# Altium project IDEC Power Board.PrjPcb
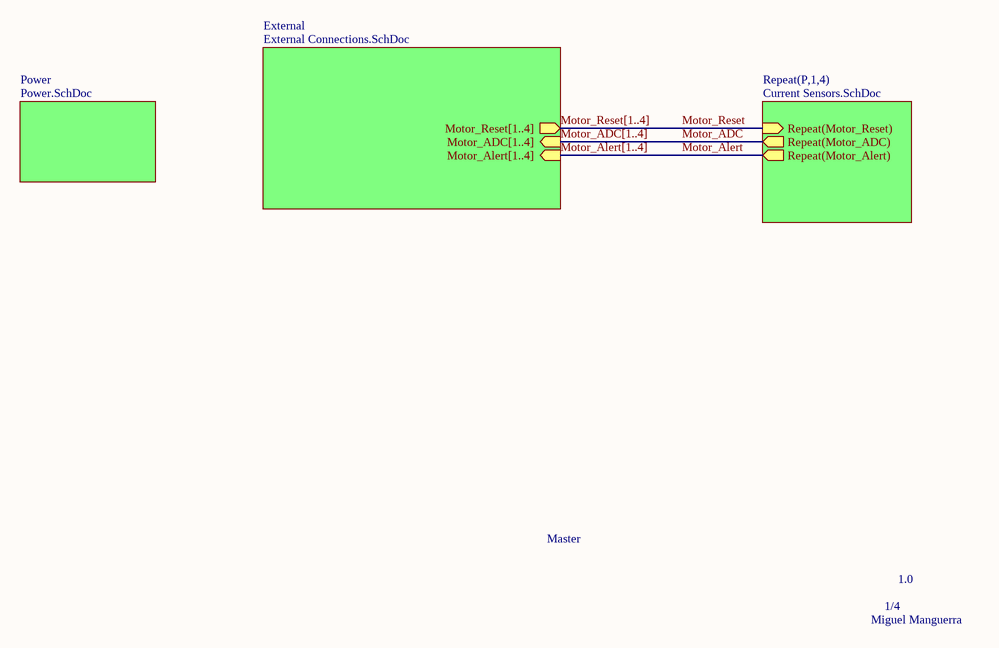
[diagram p0: Master.SchDoc]
4 sheets, 80 parts. Net scope: hierarchical (ports join the sheet entries above them; power ports are global).
Board files: Kimiya Board.PcbDoc, Miguel Board.PcbDoc, IDEC Power Board Mk1.0.PcbDoc
Sheets:
  Master.SchDoc
    Power = Power.SchDoc
    External = External Connections.SchDoc
    P1 = Current Sensors.SchDoc
    P2 = Current Sensors.SchDoc
    P3 = Current Sensors.SchDoc
    P4 = Current Sensors.SchDoc

## Sheet Master.SchDoc
size A; SheetNumber: 1; SheetTotal: 4

### Sub-sheets
External = External Connections.SchDoc: Motor_Reset[1..4] (out), Motor_ADC[1..4] (in), Motor_Alert[1..4] (in)
Power = Power.SchDoc: no entries
Repeat(P,1,4) = Current Sensors.SchDoc: Repeat(Motor_Alert) (out), Repeat(Motor_Reset) (in), Repeat(Motor_ADC) (out)

### Nets
Motor_ADC: sheet Repeat(P,1,4)/Repeat(Motor_ADC)
Motor_Alert: sheet Repeat(P,1,4)/Repeat(Motor_Alert)
Motor_Reset: sheet Repeat(P,1,4)/Repeat(Motor_Reset)

### Buses and harness runs
bus Motor_ADC[1..4] = sheet External/Motor_ADC[1..4]
bus Motor_Alert[1..4] = sheet External/Motor_Alert[1..4]
bus Motor_Reset[1..4] = sheet External/Motor_Reset[1..4]

### Notes on the sheet
- Master
- 1/4
- 1.0
- Miguel Manguerra

## Sheet Power.SchDoc
size A; SheetNumber: 2; SheetTotal: 4
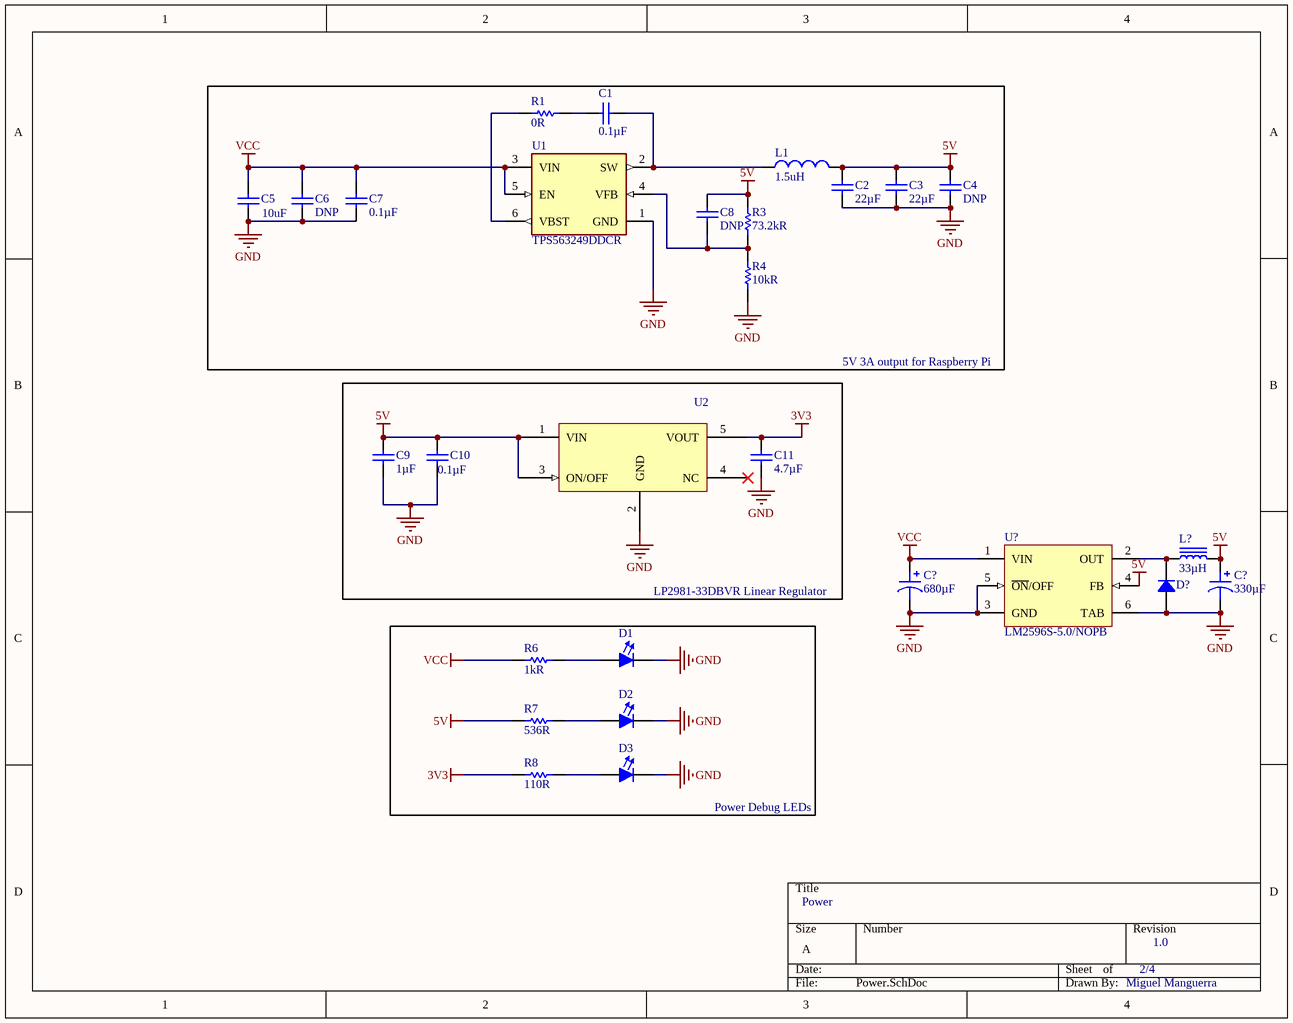
[diagram p1: Power.SchDoc]

### Parts
(Parts that share a designator on the sheet are numbered #1, #2 ... from top to bottom, then left to right.)
C1  Capacitance: 0.1µF  [CAPC1608N(0603")]  (hidden comment: 0.1uF, 50V, 10%, X7R, 0603)
C2  value 22µF  [CAPC2012N(0805")]  (hidden comment: 22uF 35V 0805 SMD, Ceramic)
C3  value 22µF  [CAPC2012N(0805")]  (hidden comment: 22uF 35V 0805 SMD, Ceramic)
C4  value DNP  [CAPC1608N(0603")]  (hidden comment: Placeholder_Capacitor_0603)
C5  Capacitance: 10uF  [CAPC2013X12N]  (hidden comment: 10uF, 25V, X5R, 0805)
C6  value DNP  [CAPC3216N(1206")]  (hidden comment: Placeholder_Capacitor_1206)
C7  Capacitance: 0.1µF  [CAPC1608N(0603")]  (hidden comment: 0.1uF, 50V, 10%, X7R, 0603)
C8  value DNP  [CAPC1608N(0603")]  (hidden comment: Placeholder_Capacitor_0603)
C9  value 1µF  [CAPC1608N(0603")]  (hidden comment: 1uF 25V 0603 SMD, Ceramic)
C10  value 0.1µF  [CAPC1608N(0603")]  (hidden comment: 0.1uF 16V 0603 SMD, Ceramic)
C11  value 4.7µF  [CAPC1608N(0603")]  (hidden comment: 4.7uF 10V 0603 SMD, Ceramic)
C?#1  680µF  [CAP ALSMD 8.3MM H10.5MM]
C?#2  330µF  [CAP ALSMD 8.3MM H10.5MM]
D1  LT Q39G-Q1OO-25-1  [FP-LB_Q39E-MFG]  (value not drawn)
D2  LT Q39G-Q1OO-25-1  [FP-LB_Q39E-MFG]  (value not drawn)
D3  LT Q39G-Q1OO-25-1  [FP-LB_Q39E-MFG]  (value not drawn)
D?  MBRS360BT3G  [DO214AA SMB]  (value not drawn)
L1  Inductance: 1.5uH  [INDC2520X12N]  (hidden comment: DFE252012P-1R5M=P2)
L?  33µH  [BOURNS SRR1280]
R1  value 0R  [RESC1608N(0603")]  (hidden comment: 0R, 1%, 1/10W, 0603 SMD)
R3  Resistance: 73.2kR  [RESC1608X55X30LL15T15]  (hidden comment: ERJ-3EKF7322V)
R4  Resistance: 10kR  [RESC1608X55X25ML10T15]  (hidden comment: RC0603FR-0710KL)
R6  Resistance: 1kR  [RESC1608X55X30ML15T15]  (hidden comment: ERJ3EKF1001V)
R7  536R  [RESC1608X55X30ML15T15]
R8  110R  [RESC1608X55X25ML10T15]
U1  TPS563249DDCR  [FP-DDC0005A-IPC_B]
U2  LP2981-33DBVR  [SOT95P280X145-5N]  (value not drawn)
U?  LM2596S-5.0/NOPB  [KTT0005B_M]

### Blocks framed on the sheet
5V 3A output for Raspberry Pi: C1-C8 L1 R1 R3 R4 U1

### Nets
3V3: C11.2(Cathode) R8.1 U2.5(VOUT)
5V: C2.2(Cathode) C3.2(Cathode) C4.2(Cathode) C8.2(Cathode) C9.2(Cathode) C10.2(Cathode) C?#2.1 L1.2 L?.2 R3.2 R7.1 U2.1(VIN) U2.3(ON/OFF) U?.4(FB)
GND: C2.1(Anode) C3.1(Anode) C4.1(Anode) C5.2 C6.1(Anode) C7.1(Anode) C9.1(Anode) C10.1(Anode) C11.1(Anode) C?#1.2 C?#2.2 D1.1(Cathode) D2.1(Cathode) D3.1(Cathode) D?.1 R4.1 U1.1(GND) U2.2(GND) U?.3(GND) U?.5(~{ON}/OFF) U?.6(TAB)
VCC: C5.1 C6.2(Cathode) C7.2(Cathode) C?#1.1 R6.1 U1.3(VIN) U1.5(EN) U?.1(VIN)
NetC1_1: C1.1(Anode) L1.1 U1.2(SW)
NetC1_2: C1.2(Cathode) R1.2
NetC8_1: C8.1(Anode) R3.1 R4.2 U1.4(VFB)
NetD1_2: D1.2(Anode) R6.2
NetD2_2: D2.2(Anode) R7.2
NetD3_2: D3.2(Anode) R8.2
NetD?_2: D?.2 L?.1 U?.2(OUT)
NetR1_1: R1.1 U1.6(VBST)

Not connected (* = marked no-connect by the designer): U2 4(NC)*

### Notes on the sheet
- LP2981-33DBVR Linear Regulator
- Power Debug LEDs
- Power
- 2/4
- 1.0
- Miguel Manguerra

### Library data of the parts
C1 C7 = CMP-006-0007-1: 0.1µF ±10% Ceramic Capacitor X7R 0603 (1608 Metric); Operating Temperature: -55°C ~ 125°C; Pin Count: 2; Design Item ID: 0.1uF, 50V, 10%, X7R, 0603; Package / Case: 0603 (1608 Metric); Source: AUVic_Schematic_Library_Capacitors.SchLib; ComponentLink1URL: https://www.digikey.ca/product-detail/en/tdk-corporation/C1608X7R1H104M080AA/445-5098-1-ND/2093713; ComponentLink1Description: Digi-Key; Mounting Type: Surface Mount, MLCC; Component Type: Standard; Created By: Poorna Chander Kalidas
C2 C3 = CMP-006-0036-1: Capacitor, Ceramic, 35V, +/- 20%, 0805 SMD, X5R; Design Item ID: 22uF 35V 0805 SMD, Ceramic; Source: AUVic_Schematic_Library_Capacitors.SchLib; Pin Count: 2; Component Type: Standard; Publisher: AUVic; PackageDescription: Chip Capacitor; Published: 14-06-01
C4 C8 = CMP-006-0054-1: Placeholder 0603 SMT Footprint; Made By: Ashwin Sira; Date Created: 2016-06-26; Design Item ID: Placeholder_Capacitor_0603; PackageDescription: Chip Capacitor; Component Type: Standard (No BOM); Pin Count: 2; Source: AUVic_Schematic_Library_Capacitors.SchLib; Publisher: AUVic
C5 = CMP-00114-1: 0805 10 uF 25 V ±10% Tolerance X5R SMT Multilayer Ceramic Capacitor; Dielectric: X7R; Max Operating Temperature: 85°C; Resistor Type: Ceramic; Lead Free: Lead Free; Tolerance: 10%; Height: 1.25mm; Package Quantity: 1; Voltage Rating: 25V; Width: 0.049inch; Min Operating Temperature: -55°C; Case Code (Imperial): 0805; Number of Pins: 2; Thickness: 0.053inch; Length: 0.079inch; Case Code (Metric): 2012; Mount: Surface Mount; Case/Package: 0805; Packaging: Tape and Reel; REACH SVHC: No SVHC; Termination: SMD/SMT; Voltage Rating (DC): 25V
C6 = CMP-006-0056-1: Placeholder 1206 SMT Footprint; Made By: Ashwin Sira; PackageDescription: Chip Capacitor; Component Type: Standard (No BOM); Source: AUVic_Schematic_Library_Capacitors.SchLib; Date Created: 2016-06-26; Design Item ID: Placeholder_Capacitor_1206; Pin Count: 2; Publisher: AUVic
C9 = CMP-006-0027-1: Capacitor, Ceramic, 25V, +/- 10%, 0603 SMD, X5R; MFG: Murata-Electronics-North-America; MFG#: GRM188R61E105KA12D; Created By: Andy Bates; Publisher: AUVic; Source: AUVic_Schematic_Library_Capacitors.SchLib; Component Type: Standard; Pin Count: 2; PackageDescription: Chip Capacitor; Design Item ID: 1uF 25V 0603 SMD, Ceramic; Published: 16-06-27
C10 = CMP-006-0005-1: Capacitor, Ceramic, 16V, +/- 10%, 0603 SMD, X7R; Created By: Andy Bates; Published: 16-04-26; PackageDescription: Chip Capacitor; Pin Count: 2; Source: AUVic_Schematic_Library_Capacitors.SchLib; Design Item ID: 0.1uF 16V 0603 SMD, Ceramic; Component Type: Standard; Publisher: AUVic
C11 = CMP-006-0043-1: Capacitor, Ceramic, 10V, +/- 10%, 0603 SMD, X5R; MFG: Samsung; MFG#: GRM188R61A475KE15D; PackageDescription: Chip Capacitor; Source: AUVic_Schematic_Library_Capacitors.SchLib; Published: 16-06-23; Created By: Ashwin Sira; Component Type: Standard; Pin Count: 2; Publisher: AUVic; Design Item ID: 4.7uF 10V 0603 SMD, Ceramic
C?#1 = EMZR160ARA681MHA0G: CAP ALUM 680UF 20% 16V SMD; Manufacturer: United Chemi-Con; ESR (Equivalent Series Resistance): 80mOhm @ 100kHz; Lifetime @ Temp.: 2000 Hrs @ 105°C; Polarization: Polar; Ripple Current @ High Frequency: 850mA @ 100kHz; Ripple Current @ Low Frequency: 510mA @ 120Hz; Surface Mount Land Size: 0.327" L x 0.327" W (8.30mm x 8.30mm); Part Number: EMZR160ARA681MHA0G; Applications: Automotive; Capacitance: 680µF; ComponentLink1Description: Datasheet; ComponentLink1URL: http://www.chemi-con.co.jp/cgi-bin/CAT_DB/SEARCH/cat_db_al.cgi?e=e&j=p&pdfname=mzr; ComponentLink2Description: DigiKey Link; ComponentLink2URL: http://digikey.com/product-detail/en/united-chemi-con/EMZR160ARA681MHA0G/565-5139-1-ND/8637134; Device Package: Radial, Can - SMD; Height - Seated (Max): 0.413" (10.50mm); LastUpdated: 9/2/2020 1:25:13 AM; Lifecycle Status: Active; Minimum Order: 1; Mounting Type: Surface Mount; Operating Temperature: -55°C ~ 105°C; Package / Case: Radial, Can - SMD; Packaging: TapeAndReel; PartId: 7809; Part Status: Active; Price: 0.33; Ratings: AEC-Q200; Series: Alchip™- MZR; Size / Dimension: 0.315" Dia (8.00mm); Supplier 1: DigiKey; Supplier Part Number 1: 565-5139-1-ND; Tolerance: ±20%; Value: 680µF; Voltage - Rated: 16V
C?#2 = UUR1E331MNL6GS: CAP ALUM 330UF 20% 25V SMD; Manufacturer: Nichicon; Lifetime @ Temp.: 2000 Hrs @ 85°C; Ripple Current @ High Frequency: 369.2mA @ 10kHz; Ripple Current @ Low Frequency: 284mA @ 120Hz; Surface Mount Land Size: 0.327" L x 0.327" W (8.30mm x 8.30mm); Part Number: UUR1E331MNL6GS; Applications: General Purpose; Capacitance: 330µF; ComponentLink1Description: Datasheet; ComponentLink1URL: http://nichicon-us.com/english/products/pdfs/e-uur.pdf; ComponentLink2Description: DigiKey Link; ComponentLink2URL: http://digikey.com/product-detail/en/nichicon/UUR1E331MNL6GS/493-6224-1-ND/3438737; Device Package: Radial, Can - SMD; Height - Seated (Max): 0.413" (10.50mm); LastUpdated: 9/2/2020 1:25:16 AM; Lifecycle Status: Active; Minimum Order: 1; Mounting Type: Surface Mount; Operating Temperature: -40°C ~ 85°C; Package / Case: Radial, Can - SMD; Packaging: TapeAndReel; PartId: 7472; Part Status: Active; Price: 0.22; Series: UUR; Size / Dimension: 0.315" Dia (8.00mm); Supplier 1: DigiKey; Supplier Part Number 1: 493-6224-1-ND; Tolerance: ±20%; Value: 330µF; Voltage - Rated: 25V
D1-D3 = CMP-00064-3: LED GREEN DIFFUSED 0603 SMD; Dominant Wavelength: 530nm; Luminous Intensity: 280mcd; Lens Style: Diffused,Colorless,Rectangular; Number of LEDs: 1; Forward Voltage: 2.85V; Test Current: 5mA; Reverse Voltage: 5V; Forward Current: 15mA; Luminous Flux: 0.55lm; Radiation Hardening: No; Packaging: Tape and Reel; Mount: Surface Mount; Color: Green; Max Operating Temperature: 85°C; Number of Elements: 1; Number of Pins: 2; Min Operating Temperature: -40°C; Depth: 0.9mm; Case/Package: SMD/SMT; Length: 1.7mm
D? = MBRS360BT3G: DIODE SCHOTTKY 60V 3A SMB; Manufacturer: ON Semiconductor; Current - Reverse Leakage @ Vr: 30µA @ 60V; Speed: Fast Recovery =< 500ns, > 200mA (Io); Voltage - Forward (Vf) (Max) @ If: 630mV @ 3A; Part Number: MBRS360BT3G; ComponentLink1Description: Datasheet; ComponentLink1URL: https://www.onsemi.com/pub/Collateral/MBRS360T3-D.PDF; ComponentLink2Description: DigiKey Link; ComponentLink2URL: http://digikey.com/product-detail/en/on-semiconductor/MBRS360BT3G/MBRS360BT3GOSCT-ND/2623453; Current - Average Rectified (Io): 3A; Diode Type: Schottky; LastUpdated: 9/2/2020 1:18:52 AM; Lifecycle Status: Active; Minimum Order: 1; Mounting Type: Surface Mount; Operating Temperature - Junction: -65°C ~ 175°C; Package / Case: DO-214AA, SMB; Packaging: TapeAndReel; PartId: 1547; Part Status: Active; Price: 0.13; Series: -; Supplier 1: DigiKey; Supplier Part Number 1: MBRS360BT3GOSCT-ND; Supplier Device Package: SMB; Voltage - DC Reverse (Vr) (Max): 60V
L1 = CMP-00112-1: Ind Metal Alloy Shielded 1.5uH 20% 1MHz Powdered Iron 2.6A 1008 T/R; Core Material: Ferrite; Current Rating: 3.5A; DC Resistance (DCR): 60mR; Packaging: Tape and Reel; Mount: Surface Mount; Depth: 2mm; Tolerance: 20%; Shielding: Shielded; Test Frequency: 1MHz; Width: 0.079inch; Case Code (Metric): 2520; Min Operating Temperature: -40°C; Resistor Type: Wirewound,Metal Alloy; Length: 0.098inch; Case/Package: 1008; Case Code (Imperial): 1008; Height - Seated (Max): 0.039inch; Max Operating Temperature: 125°C; Max DC Current: 2.6A
L? = SRR1280-330M: FIXED IND 33UH 3.5A 57 MOHM SMD; Manufacturer: Bourns Inc.; Current - Saturation: 3.3A; DC Resistance (DCR): 57mOhm Max; Frequency - Self Resonant: 9.5MHz; Inductance Frequency - Test: 100kHz; Material - Core: Ferrite; Q @ Freq: 28 @ 2.52MHz; Shielding: Shielded; Tolerance: ±20%; Type: Wirewound; Part Number: SRR1280-330M; ComponentLink1Description: Datasheet; ComponentLink1URL: https://www.bourns.com/docs/Product-Datasheets/SRR1280.pdf; ComponentLink2Description: DigiKey Link; ComponentLink2URL: http://digikey.com/product-detail/en/bourns-inc/SRR1280-330M/SRR1280-330MCT-ND/2127440; Current Rating (Amps): 3.5A; Device Package: Nonstandard; Height - Seated (Max): 0.315" (8.00mm); Inductance: 33µH; LastUpdated: 9/2/2020 1:22:09 AM; Lifecycle Status: Active; Minimum Order: 1; Mounting Type: Surface Mount; Operating Temperature: -40°C ~ 125°C; Package / Case: Nonstandard; Packaging: TapeAndReel; PartId: 25; Part Status: Active; Price: 0.65; Series: SRR1280; Size / Dimension: 0.492" L x 0.492" W (12.50mm x 12.50mm); Supplier 1: DigiKey; Supplier Part Number 1: SRR1280-330MCT-ND; Value: 33µH
R1 = CMP-047-0001-1: Made By: Ashwin Sira; Owned By: AUVic; Component Type: Standard; Design Item ID: 0R, 1%, 1/10W, 0603 SMD; Last Edited: 14-05-31; Created On: 14-05-31; Source: AUVic_Schematic_Library_Resistors.SchLib; Pin Count: 2
R3 = CMP-00029-1: Res Thick Film 0603 73.2K Ohm 1% 0.1W(1/10W) ±100ppm/C Pad SMD Automotive T/R; Max Power Dissipation: 100mW; Voltage Rating (DC): 50V; Temperature Coefficient: 100ppm/°C; Voltage Rating: 75V; Packaging: Tape and Reel; REACH SVHC: No SVHC; Case Code (Imperial): 0603; Mount: Surface Mount; Height: 0.022inch; Military Standard: Not; Features: Automotive AEC-Q200; Power Rating: 100mW; Width: 0.031inch; Termination: SMD/SMT; Number of Terminations: 2; Composition: Thick Film; Length: 1.6mm; Depth: 0.8mm; Min Operating Temperature: -55°C; Package Quantity: 1; Max Operating Temperature: 155°C; Case/Package: 0603; Case Code (Metric): 1608; Tolerance: 1%; Radiation Hardening: No; Contact Plating: Tin; Lead Free: Lead Free
R4 = CMP-00037-1: Res General Purpose Thick Film 0603 10K Ohm 1% 1/10W ±100ppm/°C Molded SMD Paper T/R; Power Rating: 100mW; Voltage Rating (DC): 50V; Voltage Rating: 75V; Case/Package: 0603; Weight: 7.1E-05oz; Case Code (Imperial): 0603; Composition: Thick Film; Depth: 0.8mm; Min Operating Temperature: -55°C; Width: 0.8mm; Height: 0.45mm; Military Standard: Not; Packaging: Tape and Reel; Termination: SMD/SMT; Lead Free: Lead Free; Temperature Coefficient: 100ppm/°C; Number of Pins: 2; Max Operating Temperature: 155°C; Lead Pitch: 0.3mm; REACH SVHC: No SVHC; Case Code (Metric): 1608; Tolerance: 1%; Length: 1.6mm
R6 = CMP-00062-2: Res Thick Film 0603 1K Ohm 1% 1/10W ±100ppm/°C Molded SMD Punched Carrier T/R; Voltage Rating (DC): 75V; Max Power Dissipation: 100mW; Package Quantity: 5000; Composition: Thick Film; Min Operating Temperature: -55°C; Case Code (Metric): 1608; Case/Package: 0603; Lead Free: Lead Free; Packaging: Tape and Reel; Case Code (Imperial): 0603; Width: 0.8mm; Military Standard: Not; Contact Plating: Tin; Length: 1.6mm; Max Operating Temperature: 155°C; Height: 0.45mm; Temperature Coefficient: 100ppm/°C; Depth: 0.8mm; Voltage Rating: 75V; Tolerance: 1%; Features: Automotive AEC-Q200; Mount: Surface Mount; REACH SVHC: No SVHC; Power Rating: 100mW; Radiation Hardening: No; Number of Terminations: 2; Number of Pins: 2; Termination: SMD/SMT
R7 = CMP-00071-2: SMD Chip Resistor, 0603 [1608 Metric], 536 ohm, ERJ3EK Series, 75 V, Thick Film, 100 mW; Tolerance: 1%; Voltage Rating (DC): 50V; Voltage Rating: 75V; Power Rating: 100mW; Temperature Coefficient: 100ppm/°C; Max Operating Temperature: 155°C; Package Quantity: 1; REACH SVHC: No SVHC; Depth: 0.8mm; Composition: Thick Film; Height: 0.022inch; Packaging: Tape and Reel; Contact Plating: Tin; Lead Free: Lead Free; Length: 1.6mm; Case/Package: 0603; Military Standard: Not; Features: Automotive AEC-Q200; Resistance: 536R; Termination: SMD/SMT; Max Power Dissipation: 100mW; Width: 0.8mm; Mount: Surface Mount; Case Code (Metric): 1608; Case Code (Imperial): 0603; Number of Terminations: 2; Min Operating Temperature: -55°C
R8 = CMP-00069-2: RES SMD 110 OHM 1% 1/10W 0603; Max Power Dissipation: 100mW; Voltage Rating (DC): 50V; Temperature Coefficient: 100ppm/°C; Working Voltage: 75V; Military Standard: Not; Termination: SMD/SMT; Number of Terminations: 2; Features: Moisture Resistant; Min Operating Temperature: -55°C; Power Rating: 100mW; Height: 0.022inch; Package Quantity: 1; Lead Free: Lead Free; Tolerance: 1%; Voltage Rating: 50V; Resistance: 110R; Composition: Thick Film; Case Code (Imperial): 0603; Length: 1.6mm; Packaging: Tape and Reel; Case Code (Metric): 1608; Max Operating Temperature: 155°C; Depth: 0.8mm; Case/Package: 0603; Width: 0.031inch
U1 = CMP-044-0004-1: 17-V, 3-A, constant 1.4-MHz synchronous step-down voltage regulator 6-SOT-23-THIN -40 to 125
U2 = CMP-044-0003-2: IC REG LINEAR 3.3V 100MA SOT23-5; Max Input Voltage: 16V; Min Input Voltage: 2.2V; Number of Regulators: 1; Output Voltage Accuracy: 2%; Polarity: Positive; Input Bias Current: 600uA; Output Type: Fixed; Dropout Voltage: 200mV; Package Quantity: 1; REACH SVHC: No SVHC; Output Voltage: 3.3V; Min Operating Temperature: -40°C; Case/Package: SOT-23; Max Output Current: 100mA; Lead Free: Lead Free; Max Operating Temperature: 125°C; Number of Outputs: 1; Number of Pins: 5; Mount: Surface Mount; Accuracy: 2%; Nominal Output Voltage: 3.3V; Output Current: 100mA; Packaging: Tape and Reel; Quiescent Current: 600uA; Radiation Hardening: No; Contact Plating: Tin,Matte
U? = CMP-0069-00269-3: SIMPLE SWITCHER® Power Converter 150 KHz 3A Step-Down Voltage Regulator, 5-pin TO-263, Pb-Free; Manufacturer: Texas Instruments; PowerWise: N; PackageTopMarking: NSUZXYTTE#*LM2596S*-5.0 P+; ComponentLink1URL: http://www.ti.com/general/docs/lit/getliterature.tsp?genericPartNumber=LM2596&fileType=pdf; PackageDescription: TO-263, Molded, .400 x .390 x .180in, 5 Lead, .067in Pitch, Surface Mount; RoHS: Y; PinCount: 5; Code_JEDEC: MO-169-AB; ComponentLink1Description: Datasheet URL; PackageReference: KTT0005B; CompType: Switcher

## Sheet External Connections.SchDoc
size A; SheetNumber: 3; SheetTotal: 4
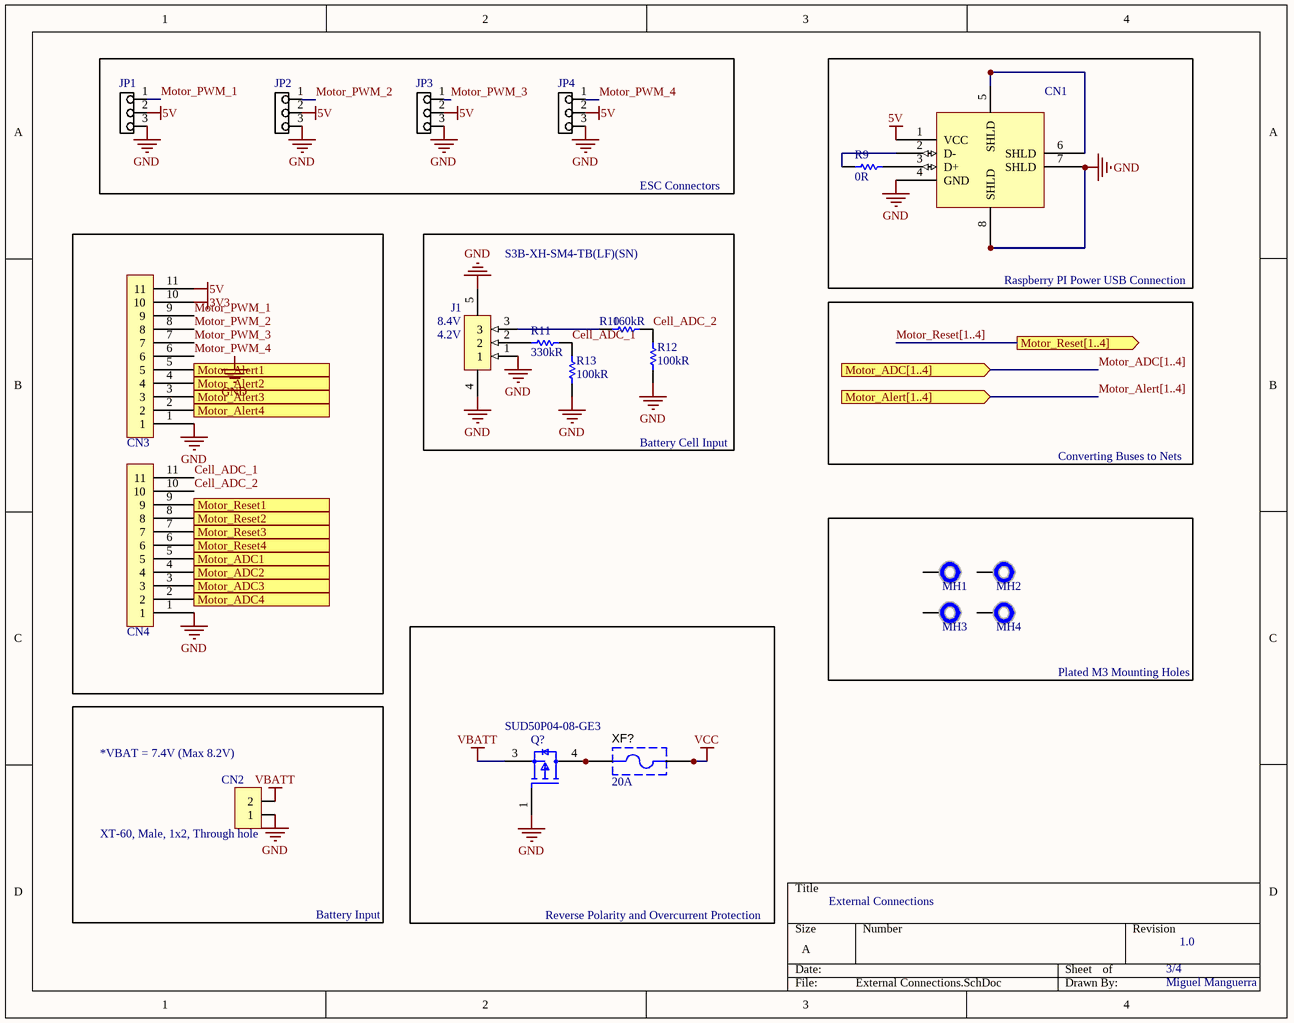
[diagram p2: External Connections.SchDoc]

### Parts
CN1  USB - Type A Female  [USB - Type A Female-Footprint-1]  (value not drawn)
CN2  XT-60, Male, 1x2, Through hole  [XT-60 Male]  (no BOM)
CN3  PH1-11-UA  [PH1-11-UA-Footprint-1]  (value not drawn)
CN4  PH1-11-UA  [PH1-11-UA-Footprint-1]  (value not drawn)
J1  S3B-XH-SM4-TB(LF)(SN)  [New footprint 1]
JP1  1x3 Male Jumper  [Header, Male, 1x3, Pitch: 0.1" (2.54mm),THT]  (value not drawn)
JP2  1x3 Male Jumper  [Header, Male, 1x3, Pitch: 0.1" (2.54mm),THT]  (value not drawn)
JP3  1x3 Male Jumper  [Header, Male, 1x3, Pitch: 0.1" (2.54mm),THT]  (value not drawn)
JP4  1x3 Male Jumper  [Header, Male, 1x3, Pitch: 0.1" (2.54mm),THT]  (value not drawn)
MH1  Mounting Hole, M3, Plated  [Clearance_M3_PLATED]  (value not drawn)  (no BOM)
MH2  Mounting Hole, M3, Plated  [Clearance_M3_PLATED]  (value not drawn)  (no BOM)
MH3  Mounting Hole, M3, Plated  [Clearance_M3_PLATED]  (value not drawn)  (no BOM)
MH4  Mounting Hole, M3, Plated  [Clearance_M3_PLATED]  (value not drawn)  (no BOM)
Q?  SUD50P04-08-GE3  [FP-T16-0236-MFG]
R9  value 0R  [RESC1608N(0603")]  (hidden comment: 0R, 1%, 1/10W, 0603 SMD)
R10  Resistance: 160kR  [RESC0603(1608)_M]  (hidden comment: RC0603FR-07160KL)
R11  Resistance: 330kR  [RESC0603(1608)_M]  (hidden comment: RMCF0603FT330K)
R12  Resistance: 100kR  [RESC1609X50X30ML10T20]  (hidden comment: CRCW0603-100KFKEA)
R13  Resistance: 100kR  [RESC1609X50X30ML10T20]  (hidden comment: CRCW0603-100KFKEA)
XF?  Current Rating: 20A  [KSTN-3557-2]  (hidden comment: 3557-2)

### Blocks framed on the sheet
ESC Connectors: JP1-JP4
Raspberry PI Power USB Connection: CN1 R9
Plated M3 Mounting Holes: MH1-MH4
Reverse Polarity and Overcurrent Protection: Q? XF?

### Ports
Motor_ADC1 (in), Motor_ADC2 (in), Motor_ADC3 (in), Motor_ADC4 (in), Motor_ADC[1..4] (in), Motor_Alert1 (in), Motor_Alert2 (in), Motor_Alert3 (in), Motor_Alert4 (in), Motor_Alert[1..4] (in), Motor_Reset1 (out), Motor_Reset2 (out), Motor_Reset3 (out), Motor_Reset4 (out), Motor_Reset[1..4] (out)

### Nets
3V3: CN3.10
5V: CN1.1(VCC) CN3.11 JP1.2 JP2.2 JP3.2 JP4.2
GND: CN1.4(GND) CN1.7(SHLD) CN1.8(SHLD) CN2.1 CN3.1 CN4.1 J1.1 J1.4 J1.5 JP1.3 JP2.3 JP3.3 JP4.3 Q?.1(G) R12.1 R13.1
VBATT: CN2.2 Q?.3(S)
VCC: XF?.3 XF?.4
Cell_ADC_1: CN4.11 R11.1 R13.2
Cell_ADC_2: CN4.10 R10.2 R12.2
Motor_PWM_1: CN3.9 JP1.1
Motor_PWM_2: CN3.8 JP2.1
Motor_PWM_3: CN3.7 JP3.1
Motor_PWM_4: CN3.6 JP4.1
NetCN1_2: CN1.2(D-) R9.1
NetCN1_3: CN1.3(D+) R9.2
NetCN1_5: CN1.5(SHLD) CN1.6(SHLD)
NetCN3_2: CN3.2 ; port Motor_Alert4
NetCN3_3: CN3.3 ; port Motor_Alert3
NetCN3_4: CN3.4 ; port Motor_Alert2
NetCN3_5: CN3.5 ; port Motor_Alert1
NetCN4_2: CN4.2 ; port Motor_ADC4
NetCN4_3: CN4.3 ; port Motor_ADC3
NetCN4_4: CN4.4 ; port Motor_ADC2
NetCN4_5: CN4.5 ; port Motor_ADC1
NetCN4_6: CN4.6 ; port Motor_Reset4
NetCN4_7: CN4.7 ; port Motor_Reset3
NetCN4_8: CN4.8 ; port Motor_Reset2
NetCN4_9: CN4.9 ; port Motor_Reset1
NetJ1_2: J1.2 R11.2
NetJ1_3: J1.3 R10.1
NetQ?_4: Q?.4(D) XF?.1 XF?.2

Not connected (* = marked no-connect by the designer): MH1 1; MH2 1; MH3 1; MH4 1

### Buses and harness runs
bus Motor_ADC[1..4] = port Motor_ADC[1..4]
bus Motor_Alert[1..4] = port Motor_Alert[1..4]
bus Motor_Reset[1..4] = port Motor_Reset[1..4]

### Notes on the sheet
- (near J1) 8.4V
- (near J1) 4.2V
- Battery Cell Input
- Converting Buses to Nets
- (near CN2) *VBAT = 7.4V (Max 8.2V)
- External Connections
- Battery Input
- 3/4
- 1.0
- Miguel Manguerra
- Labels drawn without touching a wire or pin: GND

### Library data of the parts
CN1 = CMP-00116-2: USB - Type A Female USB 2.0 THT; LCSC Part #: C168725; Created By: Miguel Manguerra
CN2 = CMP-005-0041-1: Date Published: 2016-09-08; Pin Count: 2; Source: AUVic_Schematic_Library_Connectors.SchLib; Component Type: Standard (No BOM); Design Item ID: XT-60, Male, 1x2, Through hole; Publisher: Andy Bates
CN3 CN4 = CMP-00135-1: Connector Header Through Hole 11 position 0.100" (2.54mm)
J1 = CMP-00132-1: JST (JAPAN SOLDERLESS TERMINALS) - S3B-XH-SM4-TB(LF)(SN) - Wire-To-Board Connector, XH Series, Surface Mount, Header, 3, 2.5 mm, Tin Plated Contacts RoHS Compliant: Yes; Number of Positions: 3; Pitch: 2.5mm; Contact Resistance: 20mR; Connector Type: Male Pin; Max Voltage Rating (AC): 250V; Max Current Rating: 3A; Gender: Male; Packaging: Tape and Reel; Number of Rows: 1; Length: 12.5mm; Number of Contacts: 3; Lead Free: Lead Free; Mount: Surface Mount; Contact Type: Male Pin; Color: Natural; Contact Plating: Tin,Copper; Package Quantity: 1; Max Operating Temperature: 85°C; REACH SVHC: No SVHC; Min Operating Temperature: -25°C; Orientation: Right Angle; Housing Material: Polyamide; Termination: Solder; Contact Material: Copper Alloy,Brass; Series: XH; Depth: 10mm; Housing Color: Beige; Fastening Type: Detent
JP1-JP4 = CMP-004-0002-1: Made By: Poorna Chander Kalidas; Component Type: Standard; Design Item ID: 1x3 Male Jumper; Source: AUVic_Schematic_Library_Connectors.SchLib; Pin Count: 3
MH1-MH4 = CMP-053-0000-1: Created By: Ashwin Sira; Pin Count: 1; Publisher: AUVic; Date Created: 2016-06-08; Source: AUVic_Integrated_Library_Virtual_Components.SchLib; Design Item ID: Mounting Hole, M3, Plated; Component Type: Standard (No BOM)
Q? = CMP-02550-000229-1: MOSFET P-CH 40V 50A DPAK; Manufacturer: Vishay; Gate To Source Voltage: 20V; Transconductance: 45S; Gate Charge At Vgs: 106nC @ -10V; Threshold Vgs Max: -2.5V; Continuous Drain Current: -50A; Drain To Source Voltage: -40V; Reverse Recovery Time: 35ns; Max Forward Diode Voltage: -1.5V; Input Capacitace At Vds: 5380pF @ -20V; Number Of Channels: 1; Threshold Vgs Min: -1V; Pulse Drain Current: -100A; Max Junction Temp: +150°C; Drain To Source Resistance: 0.0067Ω; Turn On Delay Time: 15ns; Depletion Mode: False; Turn Off Delay Time: 70ns; Typ Forward Diode Voltage: -0.8V; Reverse Recovery Charge: 33nC; Power Dissipation: 2.5W; Rthja Max: 50°C/W; Digikey Description: MOSFET P-CH 40V 50A DPAK; Category: Trans; Package: T16-0236; Device Class L2: Transistors; Lead Free: Yes; Temperature Range High: +150°C; RoHS: TRUE; Manufacturer Part Number: SUD50P04-08-GE3; Drain To Source Breakdown Voltage: -40V; Temperature Range Low: -55°C; Device Class L1: Discrete Semiconductors; Number Of P Channels: 1; Height: 2.507mm; Device Class L3: MOSFETs; ComponentLink2URL: http://www.vishay.com/docs/65594/sud50p04-08.pdf; ComponentLink2Description: Datasheet; Mouser Description: p-Ch Mosfet Dpak (To-252) 40v 8.1mohm @ 10v; Automotive: No; Octopart: https://octopart.com/sud50p04-08-ge3-vishay-44145278; Temperature: -55°C to +150°C
R9 = CMP-047-0001-1: Made By: Ashwin Sira; Owned By: AUVic; Component Type: Standard; Design Item ID: 0R, 1%, 1/10W, 0603 SMD; Last Edited: 14-05-31; Created On: 14-05-31; Source: AUVic_Schematic_Library_Resistors.SchLib; Pin Count: 2
R10 = CMP-00134-1: RES SMD 160K OHM 1% 1/10W 0603; Voltage Rating: 50V; Temperature Coefficient: 100ppm/°C; Max Power Dissipation: 100mW; Mount: Surface Mount; Resistor Type: Thick Film; Packaging: Tape and Reel; Features: Moisture Resistant; Min Operating Temperature: -55°C; Width: 0.031inch; Size Code: 0603; Series: RC; Tolerance: 1%; Number of Terminations: 2; RoHS Compliant: Yes; Max Operating Temperature: 155°C; Termination: SMD/SMT; Height: 0.022inch; Case/Package: 0603; Package Quantity: 1; Military Standard: Not; Case Code (Imperial): 0603; Power Rating: 100mW; Depth: 0.8mm; Length: 0.063inch; Lead Free: Lead Free; Case Code (Metric): 1608; Construction: Rectangular; Voltage Rating (DC): 50V; Technology: THICK FILM
R11 = CMP-00133-1: RES 330K OHM 1% 1/10W 0603; Max Power Dissipation: 100mW; Temperature Coefficient: 100ppm/°C; Width: 0.031inch; RoHS Compliant: Yes; Tolerance: 1%; Max Operating Temperature: 155°C; Case Code (Metric): 1608; Contact Plating: Tin,Matte; Number of Terminations: 2; Series: RMCF; Features: Automotive AEC-Q200; Length: 0.061inch; Resistor Type: Thick Film; Packaging: Tape and Reel; Min Operating Temperature: -55°C; Case/Package: 0603; Case Code (Imperial): 0603; Height: 0.022inch; Mount: Surface Mount; Radiation Hardening: No
R12 R13 = CMP-00036-2: Resistor; Thick Film; 100 Kilohms; 0.1 W; 1%; SMT; 0603; TCR 37 ppm/DegC; Tape and Reel; Power Rating: 100mW; Voltage Rating (DC): 75V; Temperature Coefficient: 100ppm/°C; Width: 0.033inch; Contact Plating: Tin,Lead; Packaging: Tape and Reel; Termination: SMD/SMT; Number of Pins: 2; Package Quantity: 10; Radiation Hardening: No; Case Code (Imperial): 0603; Military Standard: Not; REACH SVHC: Unknown; Max Power Dissipation: 100mW; Tolerance: 1%; Weight: 7.1E-05oz; Length: 1.55mm; Number of Terminations: 2; Min Operating Temperature: -55°C; Lead Free: Lead Free; Max Operating Temperature: 155°C; Composition: Thick Film; Features: Automotive AEC-Q200; Case Code (Metric): 1608; Case/Package: 0603; Depth: 0.85mm; Height: 0.45mm; Voltage Rating: 75V
XF? = CMP-00030-4: Fuse Holder; Auto; 2 in1 Blade; THM; 1 Fuse; Vertical; 30 Amps; Number of Poles: 1; Fuse Type: Automotive; Voltage: 500V; Illumination Type: Illuminated; Lead Free: Lead Free; REACH SVHC: No SVHC; Package Quantity: 1; Contact Material: Brass; Length: 19.8mm; Fuse Current: 20A; Flammability Rating: UL94 V-0; Mount: Vertical,PCB; Min Operating Temperature: -50°C; Color: Black; Termination: PC Pin; Max Operating Temperature: 145°C; Voltage Rating (AC): 500V; Number of Circuits: 1; Contact Plating: Tin; Orientation: Vertical; Material: Brass,Tin,Nylon; Depth: 6.8mm

## Sheet Current Sensors.SchDoc
size A; SheetNumber: 4; SheetTotal: 4
Used 4 times, as channels P1, P2, P3, P4. Parts and nets are listed once, with the designators drawn on the sheet.
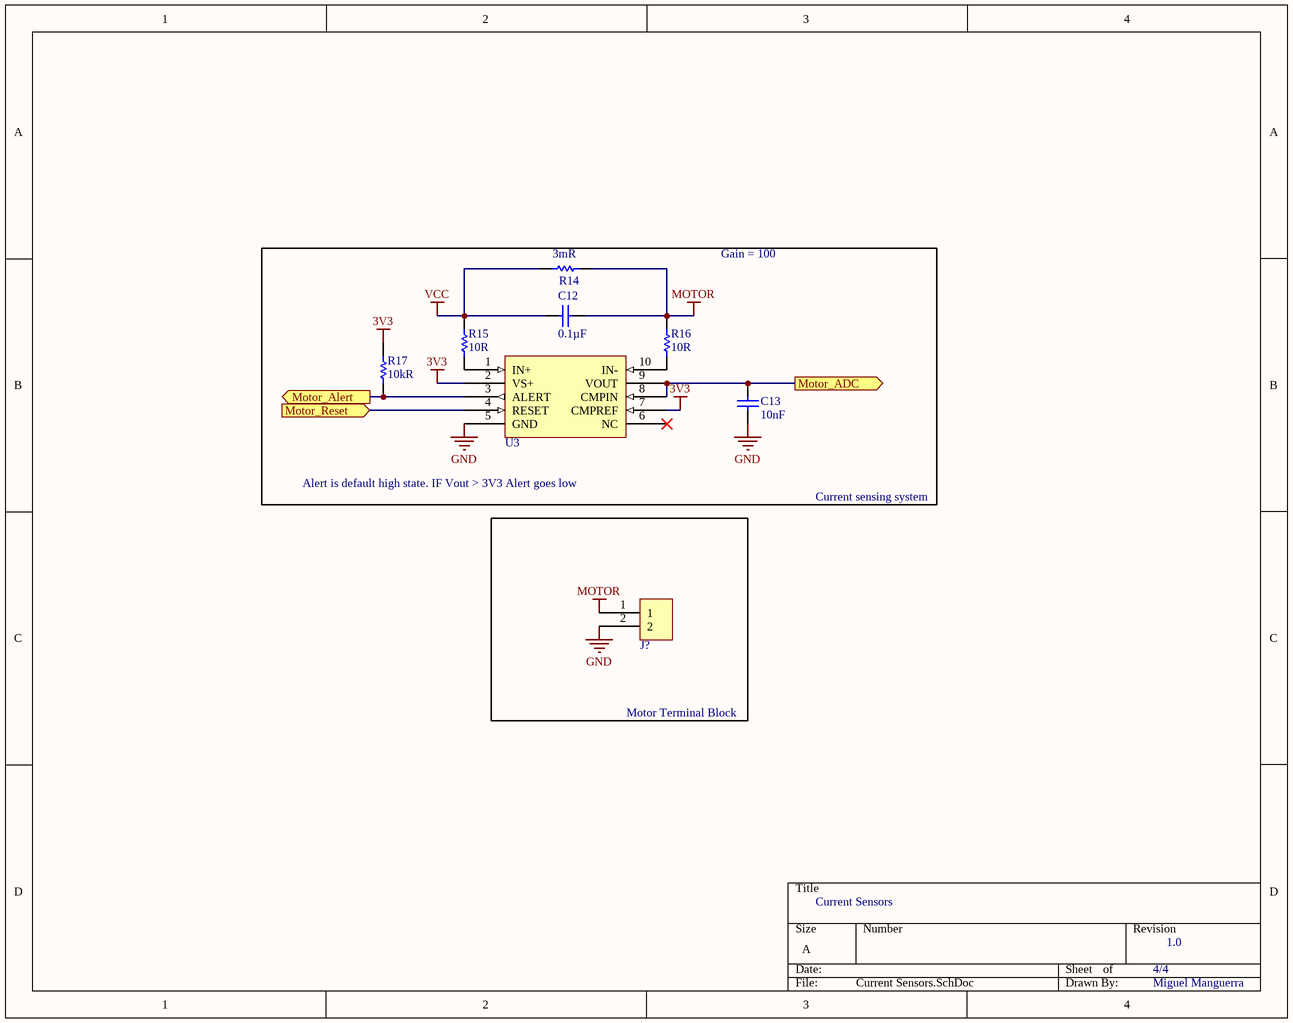
[diagram p3: Current Sensors.SchDoc]

### Parts
C12  Capacitance: 0.1µF  [CAPC1608N(0603")]  (hidden comment: 0.1uF, 50V, 10%, X7R, 0603)
C13  value 10nF  [CAPC1608N(0603")]  (hidden comment: 10 nF, 50V 0603 SMD, Ceramic)
J?  2x1 Terminal Block (5mm)  [2x1 Terminal Block (5mm)-Footprint-1]  (value not drawn)
R14  3mR, 1%, 1W, 1206  [RESC1632X07M]  (value not drawn)
R15  Resistance: 10R  [FP-ERJ3EK-IPC_A]  (hidden comment: ERJ3EKF10R0V)
R16  Resistance: 10R  [FP-ERJ3EK-IPC_A]  (hidden comment: ERJ3EKF10R0V)
R17  Resistance: 10kR  [RESC1608X55X25ML10T15]  (hidden comment: RC0603FR-0710KL)
U3  INA381A3IDGSR  [TSSOP50P490X110-10N]  (value not drawn)

### Blocks framed on the sheet
Motor Terminal Block: J?

### Ports
Motor_ADC (out), Motor_Alert (out), Motor_Reset (in)

### Nets
3V3: R17.2 U3.2(VS+) U3.7(CMPREF)
GND: C13.1(Anode) J?.2 U3.5(GND)
MOTOR: C12.1(Anode) J?.1 R14.2 R16.2
VCC: C12.2(Cathode) R14.1 R15.2
Motor_ADC: C13.2(Cathode) U3.8(CMPIN) U3.9(VOUT) ; port Motor_ADC
Motor_Alert: R17.1 U3.3(ALERT) ; port Motor_Alert
Motor_Reset: U3.4(RESET) ; port Motor_Reset
NetR15_1: R15.1 U3.1(IN+)
NetR16_1: R16.1 U3.10(IN-)

Not connected (* = marked no-connect by the designer): U3 6(NC)*

### Channels
P1: designators end in _P1; ports Motor_ADC=Motor_ADC1 Motor_Alert=Motor_Alert1 Motor_Reset=Motor_Reset1
P2: designators end in _P2; ports Motor_ADC=Motor_ADC2 Motor_Alert=Motor_Alert2 Motor_Reset=Motor_Reset2
P3: designators end in _P3; ports Motor_ADC=Motor_ADC3 Motor_Alert=Motor_Alert3 Motor_Reset=Motor_Reset3
P4: designators end in _P4; ports Motor_ADC=Motor_ADC4 Motor_Alert=Motor_Alert4 Motor_Reset=Motor_Reset4

### Notes on the sheet
- Gain = 100
- Alert is default high state. IF Vout > 3V3 Alert goes low
- Current sensing system
- Current Sensors
- 4/4
- 1.0
- Miguel Manguerra

### Library data of the parts
C12 = CMP-006-0007-1: as C1 on sheet Power; Operating Temperature: -55°C ~ 125°C; Pin Count: 2; Design Item ID: 0.1uF, 50V, 10%, X7R, 0603; Package / Case: 0603 (1608 Metric); Source: AUVic_Schematic_Library_Capacitors.SchLib; ComponentLink1URL: https://www.digikey.ca/product-detail/en/tdk-corporation/C1608X7R1H104M080AA/445-5098-1-ND/2093713; ComponentLink1Description: Digi-Key; Mounting Type: Surface Mount, MLCC; Component Type: Standard; Created By: Poorna Chander Kalidas
C13 = CMP-006-0010-1: Capacitor, Ceramic, 50V, +/- 10%, 0603 SMD; MFG: Samsung; MFG#: GRM188R61A475KE15D; Created By: Gabriel; Design Item ID: 10 nF, 50V 0603 SMD, Ceramic; PackageDescription: Chip Capacitor; Source: AUVic_Schematic_Library_Capacitors.SchLib; Published: 16-06-23; Pin Count: 2; Publisher: AUVic; Component Type: Standard
J? = CMP-00136-3: 5mm Pitch 2x1 Terminal Block; Manufacturer: Ningbo Kangnex Elec; Manufacturer PN: WJ126V-5.0-2P; LCSC PN: C8404; Created by: Miguel Manguerra; Date Created: 05/26/2021
R14 = CMP-00122-4: 3 mOhms ±1% 1W Chip Resistor Wide 1206 (3216 Metric), 0612; Resistance: 3mR
R15 R16 = CMP-00034-2: PANASONIC - ERJ3EKF10R0V - SMD Chip Resistor, 0603 [1608 Metric], 10 ohm, ERJ3EK Series, 75 V, Thick Film, 100 mW; Temperature Coefficient: 100ppm/°C; Tolerance: 1%; Max Power Dissipation: 100mW; Voltage Rating (DC): 75V; Package Quantity: 5000; Case Code (Imperial): 0603; Military Standard: Not; Depth: 0.8mm; Number of Terminations: 2; Working Voltage: 75V; Min Operating Temperature: -55°C; Width: 0.8mm; Composition: Thick Film; Packaging: Tape and Reel; Power Rating: 100mW; REACH SVHC: No SVHC; Max Operating Temperature: 155°C; Case Code (Metric): 1608; Features: Automotive AEC-Q200; Case/Package: 0603; Length: 1.6mm; Number of Pins: 2; Lead Free: Lead Free; Height: 0.45mm; Voltage Rating: 75V; Contact Plating: Tin; Termination: SMD/SMT; Mount: Surface Mount; Radiation Hardening: No
R17 = CMP-00037-1: as R4 on sheet Power; Case/Package: 0603; Weight: 7.1E-05oz; Case Code (Imperial): 0603; Composition: Thick Film; Depth: 0.8mm; Min Operating Temperature: -55°C; Width: 0.8mm; Height: 0.45mm; Military Standard: Not; Packaging: Tape and Reel; Termination: SMD/SMT; Lead Free: Lead Free; Temperature Coefficient: 100ppm/°C; Number of Pins: 2; Max Operating Temperature: 155°C; Lead Pitch: 0.3mm; REACH SVHC: No SVHC; Case Code (Metric): 1608; Tolerance: 1%; Length: 1.6mm
U3 = CMP-00120-1: 26V, 350kHz current sense amplifier w/ integrated over-current comparator 10-VSSOP -40 to 125

## Nets that join several sheets
3V3: Power (C11.2 R8.1 U2.5), External Connections (CN3.10), P1 (R17_P1.2 U3_P1.2 U3_P1.7), P2 (R17_P2.2 U3_P2.2 U3_P2.7), P3 (R17_P3.2 U3_P3.2 U3_P3.7), P4 (R17_P4.2 U3_P4.2 U3_P4.7)
5V: Power (14 pins), External Connections (6 pins)
GND: Power (21 pins), External Connections (16 pins), P1 (C13_P1.1 J?_P1.2 U3_P1.5), P2 (C13_P2.1 J?_P2.2 U3_P2.5), P3 (C13_P3.1 J?_P3.2 U3_P3.5), P4 (C13_P4.1 J?_P4.2 U3_P4.5)
MOTOR: P1 (C12_P1.1 J?_P1.1 R14_P1.2 R16_P1.2), P2 (C12_P2.1 J?_P2.1 R14_P2.2 R16_P2.2), P3 (C12_P3.1 J?_P3.1 R14_P3.2 R16_P3.2), P4 (C12_P4.1 J?_P4.1 R14_P4.2 R16_P4.2)
VCC: Power (8 pins), External Connections (XF?.3 XF?.4), P1 (C12_P1.2 R14_P1.1 R15_P1.2), P2 (C12_P2.2 R14_P2.1 R15_P2.2), P3 (C12_P3.2 R14_P3.1 R15_P3.2), P4 (C12_P4.2 R14_P4.1 R15_P4.2)